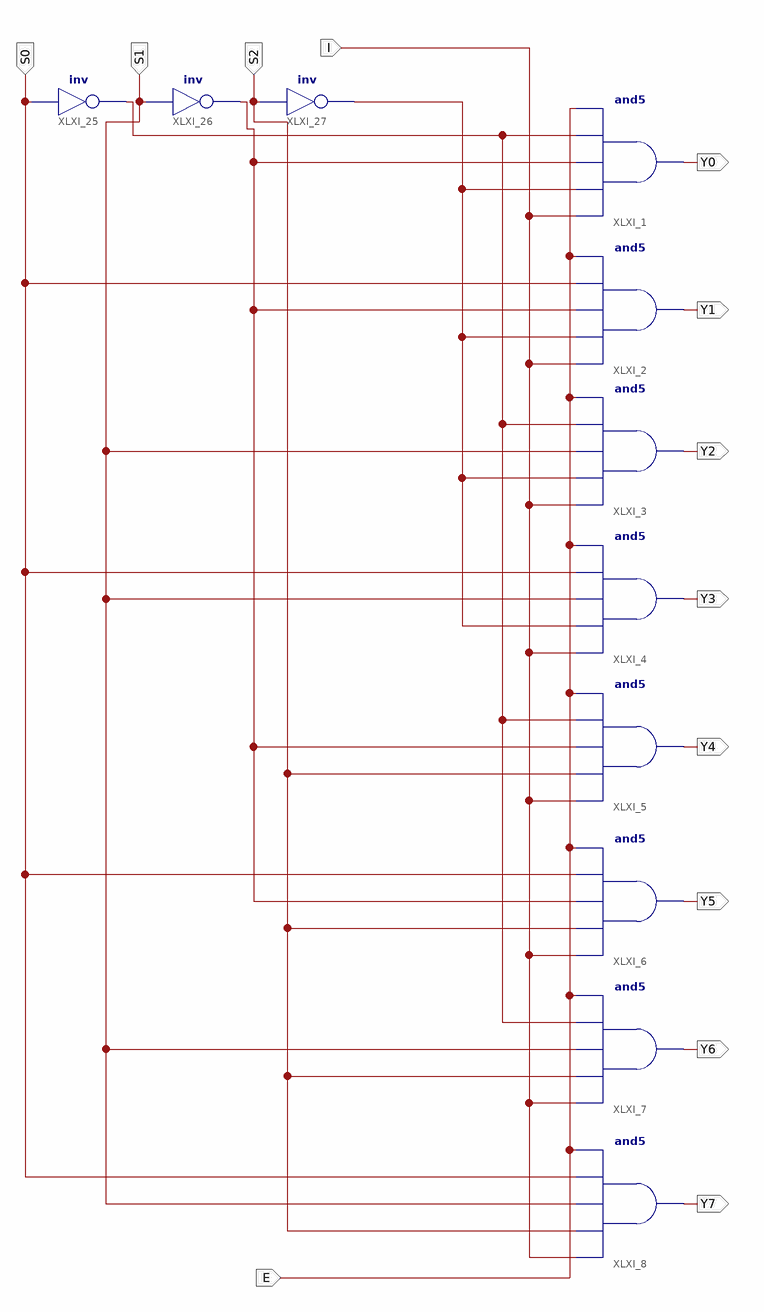
[diagram p0: schematic sheet 1]
// Xilinx ISE schematic DEMUX_1_8_WITH_AND.sch (artix7) as structural Verilog: 11 symbols, 13 ports
module DEMUX_1_8_WITH_AND (
  input  I,
  input  E,
  input  S0,
  input  S1,
  input  S2,
  output Y0,
  output Y1,
  output Y2,
  output Y3,
  output Y4,
  output Y5,
  output Y6,
  output Y7
);

  wire XLXN_22, XLXN_23, XLXN_42;

  and XLXI_1 (Y0, I, XLXN_23, XLXN_22, XLXN_42, E);
  and XLXI_2 (Y1, I, XLXN_23, XLXN_22, S0, E);
  and XLXI_3 (Y2, I, XLXN_23, S1, XLXN_42, E);
  and XLXI_4 (Y3, I, XLXN_23, S1, S0, E);
  and XLXI_5 (Y4, I, S2, XLXN_22, XLXN_42, E);
  and XLXI_6 (Y5, I, S2, XLXN_22, S0, E);
  and XLXI_7 (Y6, I, S2, S1, XLXN_42, E);
  and XLXI_8 (Y7, I, S2, S1, S0, E);
  not XLXI_25 (XLXN_42, S0);
  not XLXI_26 (XLXN_22, S1);
  not XLXI_27 (XLXN_23, S2);
endmodule
